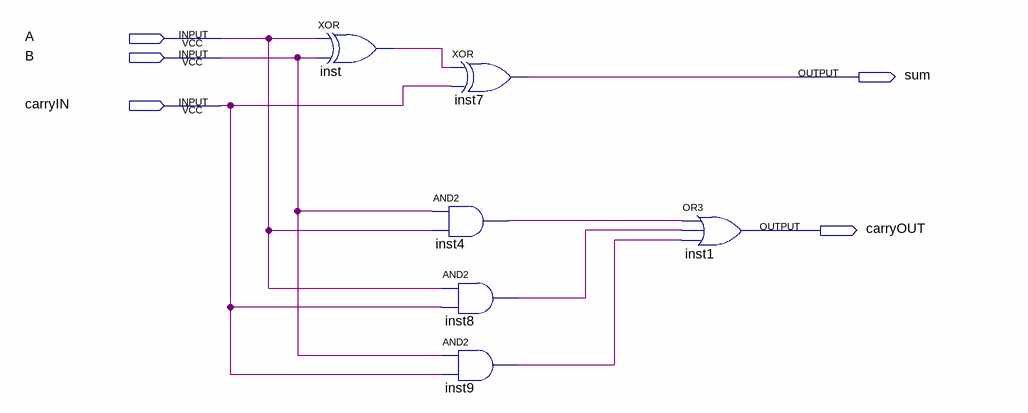
[diagram p0: schematic sheet]
// Quartus schematic SomadorP.bdf as structural Verilog: 6 symbols, 5 pins
module SomadorP (
  input  A,
  input  B,
  input  carryIN,
  output sum,
  output carryOUT
);

  wire inst4_out, inst8_out, inst9_out, inst_out;

  xor inst (inst_out, A, B);
  and inst4 (inst4_out, B, A);
  and inst8 (inst8_out, A, carryIN);
  and inst9 (inst9_out, B, carryIN);
  xor inst7 (sum, inst_out, carryIN);
  or inst1 (carryOUT, inst4_out, inst8_out, inst9_out);
endmodule
